# Altium schematic sheet XMC4800-ECAT-P0.SchDoc: XMC4800-ECAT-P0
size A4
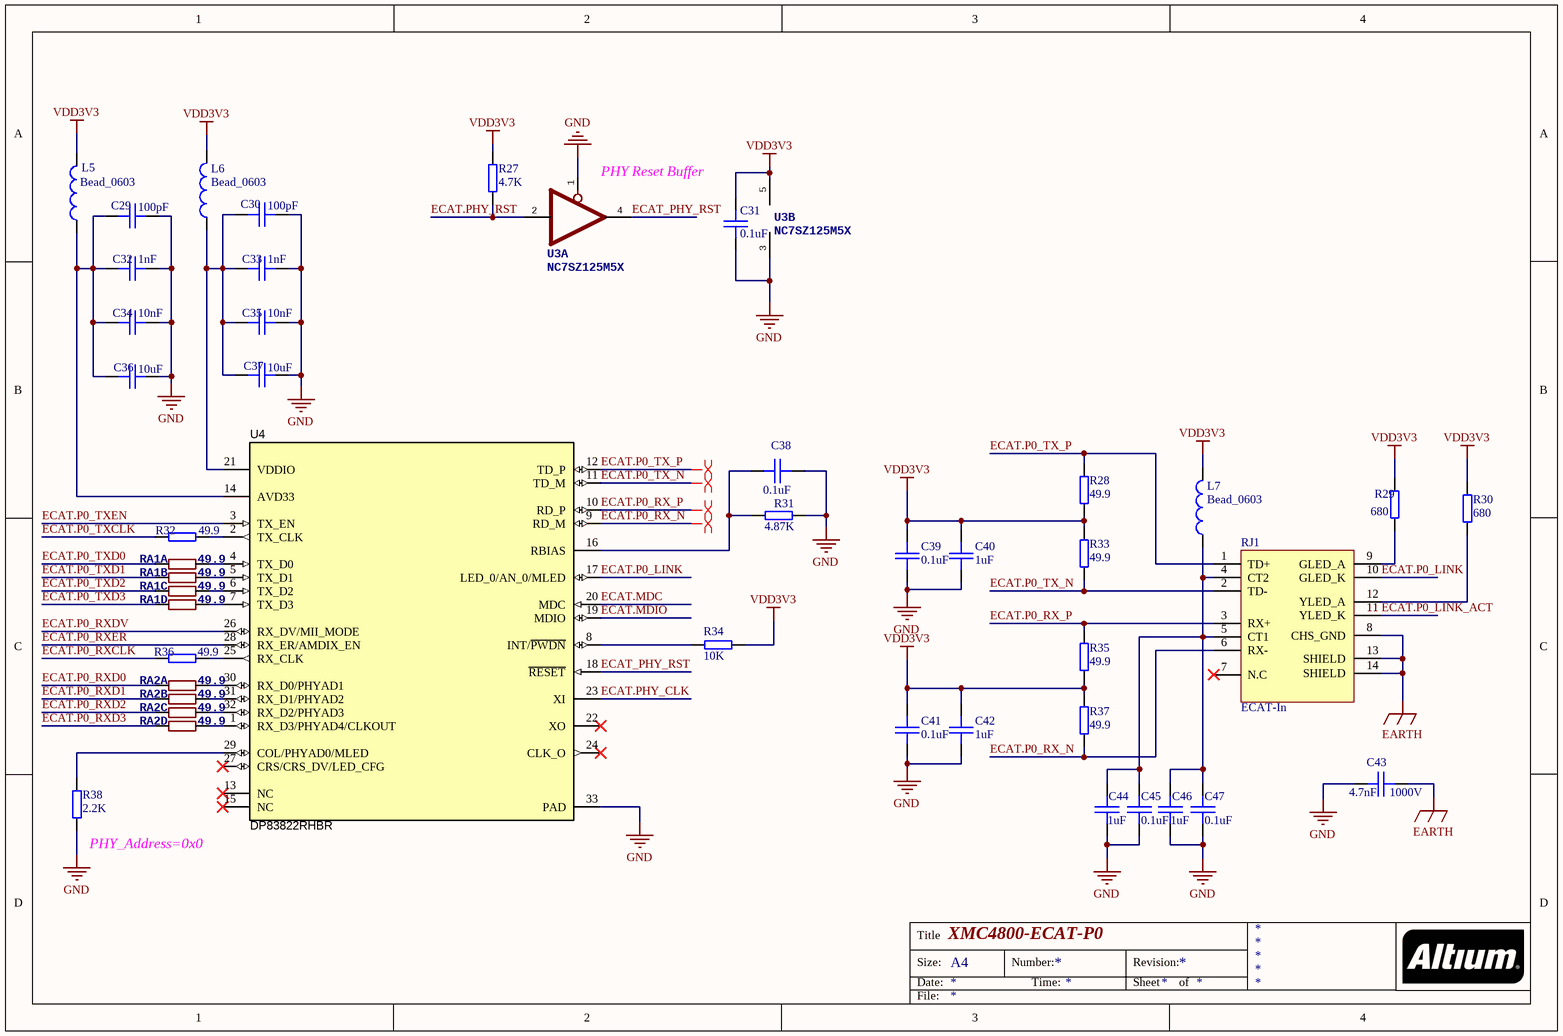
[diagram p0: XMC4800-ECAT-P0.SchDoc]

## Parts
C29  100pF  [CAP-0603]
C30  100pF  [CAP-0603]
C31  0.1uF  [CAP-0603]
C32  1nF  [CAP-0603]
C33  1nF  [CAP-0603]
C34  10nF  [CAP-0603]
C35  10nF  [CAP-0603]
C36  10uF  [CAP-0603]
C37  10uF  [CAP-0603]
C38  0.1uF  [CAP-0603]
C39  0.1uF  [CAP-0603]
C40  1uF  [CAP-0603]
C41  0.1uF  [CAP-0603]
C42  1uF  [CAP-0603]
C43  4.7nF  voltage: 1000V  [CAP-1206]
C44  1uF  [CAP-0603]
C45  0.1uF  [CAP-0603]
C46  1uF  [CAP-0603]
C47  0.1uF  [CAP-0603]
L5  Bead_0603  [L-0603]
L6  Bead_0603  [L-0603]
L7  Bead_0603  [L-0603]
R27  4.7K  [RES-0603]
R28  49.9  [RES-0603]
R29  680  [RES-0603]
R30  680  [RES-0603]
R31  4.87K  [RES-0603]
R32  49.9  [RES-0603]
R33  49.9  [RES-0603]
R34  10K  [RES-0603]
R35  49.9  [RES-0603]
R36  49.9  [RES-0603]
R37  49.9  [RES-0603]
R38  2.2K  [RES-0603]
RA1  49.9  [LC-0603_Rx4]  (parts A,B,C,D of 4)
RA2  49.9  [LC-0603_Rx4]  (parts A,B,C,D of 4)
RJ1  ECAT-In  [HR911105A]
U3  NC7SZ125M5X  [LC-SOT-23-5]  (parts A,B of 2)
U4  DP83822RHBR  [RHB0032B]

## Nets
EARTH: C43.2 RJ1.8(CHS_GND) RJ1.13(SHIELD) RJ1.14(SHIELD)
GND: C29.2 C30.2 C31.2 C32.1 C33.1 C34.1 C35.1 C36.1 C37.1 C38.2 C39.2 C40.2 C41.2 C42.2 C43.1 C44.2 C45.2 C46.2 C47.2 R31.2 R38.1 U3.1(OE) U3.3(GND) U4.33(PAD)
VDD3V3: C31.1 C39.1 C40.1 C41.1 C42.1 L5.2 L6.2 L7.2 R27.2 R28.1 R29.2 R30.1 R33.2 R34.2 R35.1 R37.2 U3.5(VDD)
ECAT.MDC: U4.20(MDC)
ECAT.MDIO: U4.19(MDIO)
ECAT.P0_LINK: RJ1.10(GLED_K) U4.17(LED_0/AN_0/MLED)
ECAT.P0_LINK_ACT: RJ1.11(YLED_K)
ECAT.P0_RX_N: R37.1 RJ1.6(RX-) U4.9(RD_M)
ECAT.P0_RX_P: R35.2 RJ1.3(RX+) U4.10(RD_P)
ECAT.P0_RXCLK: R36.1
ECAT.P0_RXD0: RA2.1
ECAT.P0_RXD1: RA2.2
ECAT.P0_RXD2: RA2.3
ECAT.P0_RXD3: RA2.4
ECAT.P0_RXDV: U4.26(RX_DV/MII_MODE)
ECAT.P0_RXER: U4.28(RX_ER/AMDIX_EN)
ECAT.P0_TX_N: R33.1 RJ1.2(TD-) U4.11(TD_M)
ECAT.P0_TX_P: R28.2 RJ1.1(TD+) U4.12(TD_P)
ECAT.P0_TXCLK: R32.1
ECAT.P0_TXD0: RA1.1
ECAT.P0_TXD1: RA1.2
ECAT.P0_TXD2: RA1.3
ECAT.P0_TXD3: RA1.4
ECAT.P0_TXEN: U4.3(TX_EN)
ECAT.PHY_CLK: U4.23(XI)
ECAT.PHY_RST: R27.1 U3.2(I)
ECAT_PHY_RST: U3.4(O) U4.18(~{RESET})
NetC29_1: C29.1 C32.2 C34.2 C36.2 L5.1 U4.14(AVD33)
NetC30_1: C30.1 C33.2 C35.2 C37.2 L6.1 U4.21(VDDIO)
NetC38_1: C38.1 R31.1 U4.16(RBIAS)
NetC44_1: C44.1 C45.1 C46.1 C47.1 L7.1 RJ1.4(CT2) RJ1.5(CT1)
NetR29_1: R29.1 RJ1.9(GLED_A)
NetR30_2: R30.2 RJ1.12(YLED_A)
NetR32_2: R32.2 U4.2(TX_CLK)
NetR34_1: R34.1 U4.8(INT/~{PWDN})
NetR36_2: R36.2 U4.25(RX_CLK)
NetR38_2: R38.2 U4.29(COL/PHYAD0/MLED)
NetRA1_5: RA1.5 U4.7(TX_D3)
NetRA1_6: RA1.6 U4.6(TX_D2)
NetRA1_7: RA1.7 U4.5(TX_D1)
NetRA1_8: RA1.8 U4.4(TX_D0)
NetRA2_5: RA2.5 U4.1(RX_D3/PHYAD4/CLKOUT)
NetRA2_6: RA2.6 U4.32(RX_D2/PHYAD3)
NetRA2_7: RA2.7 U4.31(RX_D1/PHYAD2)
NetRA2_8: RA2.8 U4.30(RX_D0/PHYAD1)

Not connected (* = marked no-connect by the designer): RJ1 7(N.C)*; U4 13(NC)* 15(NC)* 22(XO)* 24(CLK_O)* 27(CRS/CRS_DV/LED_CFG)*

## Layout directives
differential pair: ECAT.P0_RX_N, ECAT.P0_RX_P, ECAT.P0_TX_N, ECAT.P0_TX_P

## Notes on the sheet
- (near U3) PHY Reset Buffer
- (near R38) PHY_Address=0x0
- Title
- Size:
- Date:
- A4
- Number:
- Time:
- Revision:
- Sheet
- of
- File:

## Library data of the parts
C29-C42 C44-C47 = C_0603: 陶瓷贴片电容0603; tolerance: 10%; voltage: 50V; ESR: 1.73mOhm; IRMS: 5.59A; Series: X7R
  C29 C30: C_value: 100pF
  C31 C38 C39 C41 C45 C47: C_value: 0.1uF
  C32 C33: C_value: 1nF
  C34 C35: C_value: 10nF
  C36 C37: C_value: 10uF
  C40 C42 C44 C46: C_value: 1uF
C43 = C_1206: 陶瓷贴片电容1206; tolerance: 10%; C_value: 4.7nF
L5-L7 = Bead_0603: 贴片磁珠0603; Impedance: 120Ohm; Current: 2A
R27-R38 = R_0603: 贴片电阻0603; tolerance: 5%; voltage: 50V; power: 0.063W
  R27: R_value: 4.7K
  R28 R32 R33 R35-R37: R_value: 49.9
  R29 R30: R_value: 680
  R31: R_value: 4.87K
  R34: R_value: 10K
  R38: R_value: 2.2K
RA1 RA2 = RS_ARR4: 排阻; R_Value: 49.9
RJ1 = HR911105A: Input; LatestRevisionDate: 17-Jul-2002; LatestRevisionNote: Re-released for DXP Platform.; Publisher: Altium Limited
U3 = NC7SZ125M5X: 单通道缓冲器，3态输出
U4 = DP83822RHBR: 10/100 Ethernet PHY, RHB0032B; Alternate PartNumber: DP83822RHBT; Manufacturer: Texas Instruments; SymbolCreator: Altium; SizeArea_mm2: 25; SizeAreaWB_mm2: 49; SizeX_mm: 5; SizeZ_mm: 1; CompType: IC; U/M: EA; SymbolVersion: 2016-3-6; PartNumber: DP83822RHBR; PackageReference: RHB0032B; PackageDescription: VQFN-32; MountType: SMT; SizeY_mm: 5; ComponentLink1Description: Datasheet Link; ComponentLink1URL: https://sps06.itg.ti.com/sites/KMS/crossdivteams/altium/docs/ComponentDatasheets/DP83822 Hardware Requirements.docx; RoHS: Y; Publisher: Texas Instruments; LatestRevisionDate: 2016-07-20; Alternate Manufacturer: Texas Instruments